# EAGLE schematic RC-Stepper (EAGLE 7.6.0)
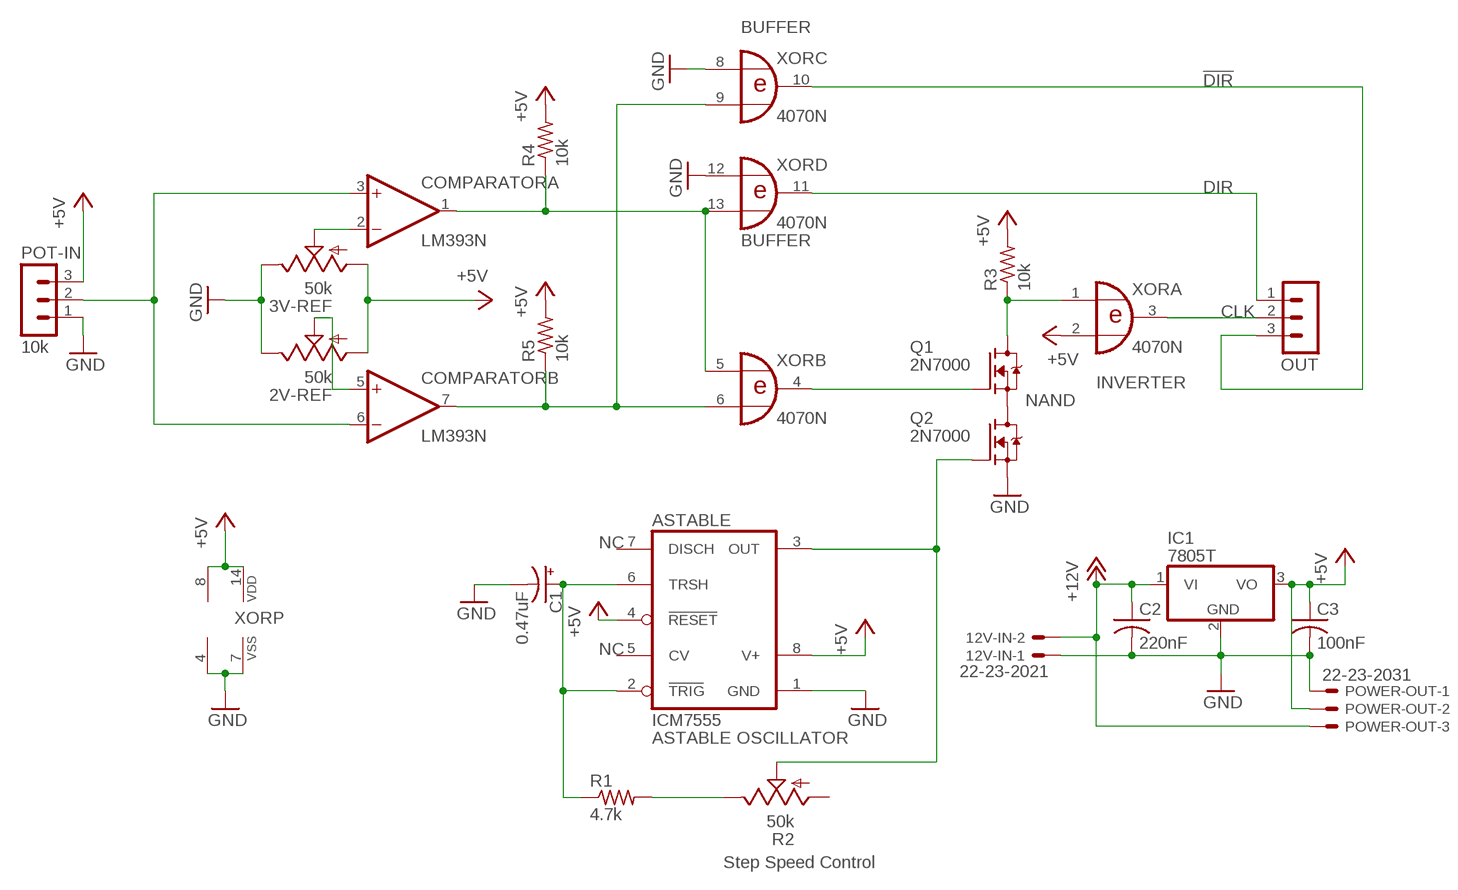
[diagram p0: schematic, sheet 1]

## Parts
2V-REF  50k  TRIM_US-PT-SPIN  [PT-SPIN]
3V-REF  50k  TRIM_US-PT-SPIN  [PT-SPIN]
12V-IN  22-23-2021  [22-23-2021]
ASTABLE  ICM7555  [DIL08]
C1  0.47uF  CPOL-USE2.5-6  [E2,5-6]
C2  220nF  C-US025-030X050  [C025-030X050]
C3  100nF  C-US025-030X050  [C025-030X050]
COMPARATOR  LM393N  [DIL08]
IC1  7805T  [TO220H]
OUT  MA03-1  [MA03-1]
POT-IN  10k  MA03-1  [MA03-1]
POWER-OUT  22-23-2031  [22-23-2031]
Q1  2N7000  [TO92-]
Q2  2N7000  [TO92-]
R1  4.7k  R-US_0204/7  [0204/7]
R2  50k  TRIM_US-B25P  [B25P]
R3  10k  R-US_0204/7  [0204/7]
R4  10k  R-US_0204/7  [0204/7]
R5  10k  R-US_0204/7  [0204/7]
XOR  4070N  [DIL14]

## Nets
+5V: 2V-REF.A 3V-REF.A ASTABLE.4(RESET) ASTABLE.8(V+) C3.1 COMPARATOR.8(P:V+) IC1.3(VO) POT-IN.3 POWER-OUT.2 R3.2 R4.2 R5.2 XOR.2(A:I1) XOR.14(P:VDD)
+12V: 12V-IN.2 C2.1 IC1.1(VI) POWER-OUT.3
GND: 2V-REF.E 3V-REF.E 12V-IN.1 ASTABLE.1(GND) C1.- C2.2 C3.2 COMPARATOR.4(P:V-) IC1.2(GND) POT-IN.1 POWER-OUT.1 Q2.3(S) XOR.7(P:VSS) XOR.8(C:I0) XOR.12(D:I0)
N$1: COMPARATOR.1(A:OUT) R4.1 XOR.5(B:I0) XOR.13(D:I1)
N$2: ASTABLE.2(TRIG) ASTABLE.6(TRSH) C1.+ R1.1
N$3: R1.2 R2.E
N$4: ASTABLE.3(OUT) Q2.2(G) R2.S
N$5: Q1.3(S) Q2.1(D)
N$6: Q1.1(D) R3.1 XOR.1(A:I0)
N$7: OUT.2 XOR.3(A:O)
N$8: Q1.2(G) XOR.4(B:O)
N$9: COMPARATOR.3(A:+IN) COMPARATOR.6(B:-IN) POT-IN.2
N$10: 3V-REF.S COMPARATOR.2(A:-IN)
N$11: 2V-REF.S COMPARATOR.5(B:+IN)
N$12: OUT.1 XOR.11(D:O)
N$13: OUT.3 XOR.10(C:O)
N$14: COMPARATOR.7(B:OUT) R5.1 XOR.6(B:I1) XOR.9(C:I1)
Unconnected: ASTABLE.5(CV) ASTABLE.7(DISCH) R2.A

## Notes on the sheet
- BUFFER
- !DIR
- DIR
- BUFFER
- CLK
- INVERTER
- NAND
- NC
- NC
- ASTABLE OSCILLATOR
- Step Speed Control

## Library data of the parts
2V-REF 3V-REF R2 = pot:TRIM_US-: POTENTIOMETER
12V-IN = con-molex:22-23-2021: .100" (2.54mm) Center Header - 2 Pin; MF: MOLEX; MPN: 22-23-2021; OC_FARNELL: 1462926; OC_NEWARK: 25C3832
ASTABLE = maxim:ICM7555: TIMER; MF: MAXIM; MPN: ICM7555IPA+; OC_FARNELL: 9663762; OC_NEWARK: 68K4387
C1 = rcl:CPOL-US: POLARIZED CAPACITOR, American symbol
C2 C3 = rcl:C-US: CAPACITOR, American symbol
COMPARATOR = linear:LM393: COMPARATOR
IC1 = linear:78*: Positive VOLTAGE REGULATOR Source: http://cache.national.com/ds/LM/LM78L05.pdf http://www.fairchildsemi.com/ds/LM/LM7805.pdf
OUT POT-IN = con-lstb:MA03-1: PIN HEADER; OC_FARNELL: unknown; OC_NEWARK: unknown
POWER-OUT = con-molex:22-23-2031: .100" (2.54mm) Center Header - 3 Pin; MF: MOLEX; MPN: 22-23-2031; OC_FARNELL: 1462950; OC_NEWARK: 30C0862
Q1 Q2 = transistor-fet:2N7000: 2n7000 N-Channel Mosfet, 60V/200mA
R1 R3-R5 = resistor:R-US_: RESISTOR, American symbol
XOR = 40xx:4070: Quad 2-input XOR